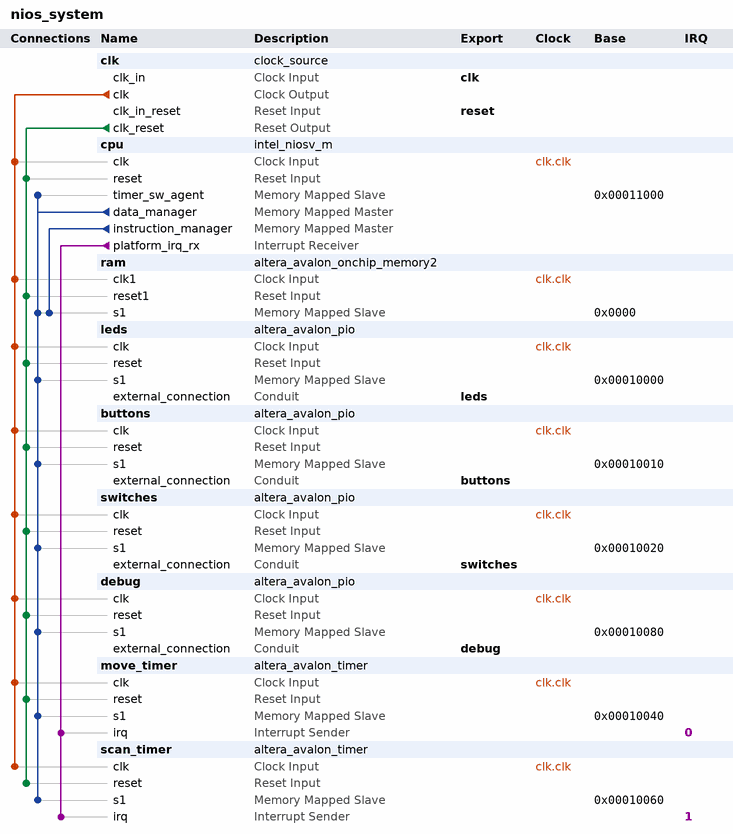
[diagram p0: system contents]
# Platform Designer (Qsys) system nios_system, Cyclone V 5CSEMA5F31C6
# Parameters at their usual value, and those the tool derives, are not listed.
package require -exact qsys 25.1
create_system nios_system
set_project_property DEVICE_FAMILY {Cyclone V}
set_project_property DEVICE 5CSEMA5F31C6

add_instance clk clock_source 25.1
set_instance_parameter_value clk clockFrequency 50000000
set_instance_parameter_value clk resetSynchronousEdges DEASSERT

add_instance cpu intel_niosv_m 26.0.0
set_instance_parameter_value cpu enableAvalonInterface true
set_instance_parameter_value cpu enableDebug false
set_instance_parameter_value cpu enableDebugReset false
set_instance_parameter_value cpu enableECCFull false
set_instance_parameter_value cpu enableECCLite false
set_instance_parameter_value cpu hartId 0
set_instance_parameter_value cpu interruptMode 0
set_instance_parameter_value cpu pipelineArch true
set_instance_parameter_value cpu resetSlave ram.s1

add_instance ram altera_avalon_onchip_memory2 25.1
set_instance_parameter_value ram dataWidth 32
set_instance_parameter_value ram dualPort false
set_instance_parameter_value ram initMemContent true
set_instance_parameter_value ram initializationFileName firmware.hex
set_instance_parameter_value ram memorySize 32768
set_instance_parameter_value ram useNonDefaultInitFile true

add_instance leds altera_avalon_pio 25.1
set_instance_parameter_value leds direction Output
set_instance_parameter_value leds width 4

add_instance buttons altera_avalon_pio 25.1
set_instance_parameter_value buttons direction Input
set_instance_parameter_value buttons width 4

add_instance switches altera_avalon_pio 25.1
set_instance_parameter_value switches direction Input
set_instance_parameter_value switches width 1

add_instance debug altera_avalon_pio 25.1
set_instance_parameter_value debug direction Output
set_instance_parameter_value debug width 32

add_instance move_timer altera_avalon_timer 25.1
set_instance_parameter_value move_timer period 25000000
set_instance_parameter_value move_timer periodUnits CLOCKS

add_instance scan_timer altera_avalon_timer 25.1
set_instance_parameter_value scan_timer period 50000
set_instance_parameter_value scan_timer periodUnits CLOCKS

# connections
add_connection clk.clk buttons.clk clock
add_connection clk.clk cpu.clk clock
add_connection clk.clk debug.clk clock
add_connection clk.clk leds.clk clock
add_connection clk.clk move_timer.clk clock
add_connection clk.clk ram.clk1 clock
add_connection clk.clk scan_timer.clk clock
add_connection clk.clk switches.clk clock
add_connection clk.clk_reset buttons.reset reset
add_connection clk.clk_reset cpu.reset reset
add_connection clk.clk_reset debug.reset reset
add_connection clk.clk_reset leds.reset reset
add_connection clk.clk_reset move_timer.reset reset
add_connection clk.clk_reset ram.reset1 reset
add_connection clk.clk_reset scan_timer.reset reset
add_connection clk.clk_reset switches.reset reset
add_connection cpu.data_manager buttons.s1 avalon
set_connection_parameter_value cpu.data_manager/buttons.s1 baseAddress 0x00010010
add_connection cpu.data_manager cpu.timer_sw_agent avalon
set_connection_parameter_value cpu.data_manager/cpu.timer_sw_agent baseAddress 0x00011000
add_connection cpu.data_manager debug.s1 avalon
set_connection_parameter_value cpu.data_manager/debug.s1 baseAddress 0x00010080
add_connection cpu.data_manager leds.s1 avalon
set_connection_parameter_value cpu.data_manager/leds.s1 baseAddress 0x00010000
add_connection cpu.data_manager move_timer.s1 avalon
set_connection_parameter_value cpu.data_manager/move_timer.s1 baseAddress 0x00010040
add_connection cpu.data_manager ram.s1 avalon
set_connection_parameter_value cpu.data_manager/ram.s1 baseAddress 0x0000
add_connection cpu.data_manager scan_timer.s1 avalon
set_connection_parameter_value cpu.data_manager/scan_timer.s1 baseAddress 0x00010060
add_connection cpu.data_manager switches.s1 avalon
set_connection_parameter_value cpu.data_manager/switches.s1 baseAddress 0x00010020
add_connection cpu.instruction_manager ram.s1 avalon
set_connection_parameter_value cpu.instruction_manager/ram.s1 baseAddress 0x0000
add_connection cpu.platform_irq_rx move_timer.irq interrupt
set_connection_parameter_value cpu.platform_irq_rx/move_timer.irq irqNumber 0
add_connection cpu.platform_irq_rx scan_timer.irq interrupt
set_connection_parameter_value cpu.platform_irq_rx/scan_timer.irq irqNumber 1

# exported interfaces
add_interface buttons conduit end
set_interface_property buttons EXPORT_OF buttons.external_connection
add_interface clk clock sink
set_interface_property clk EXPORT_OF clk.clk_in
add_interface debug conduit end
set_interface_property debug EXPORT_OF debug.external_connection
add_interface leds conduit end
set_interface_property leds EXPORT_OF leds.external_connection
add_interface reset reset sink
set_interface_property reset EXPORT_OF clk.clk_in_reset
add_interface switches conduit end
set_interface_property switches EXPORT_OF switches.external_connection

set_interconnect_requirement {$system} qsys_mm.clockCrossingAdapter HANDSHAKE
set_interconnect_requirement {$system} qsys_mm.enableEccProtection FALSE
set_interconnect_requirement {$system} qsys_mm.insertDefaultSlave FALSE
set_interconnect_requirement {$system} qsys_mm.maxAdditionalLatency 1

save_system nios_system.qsys
